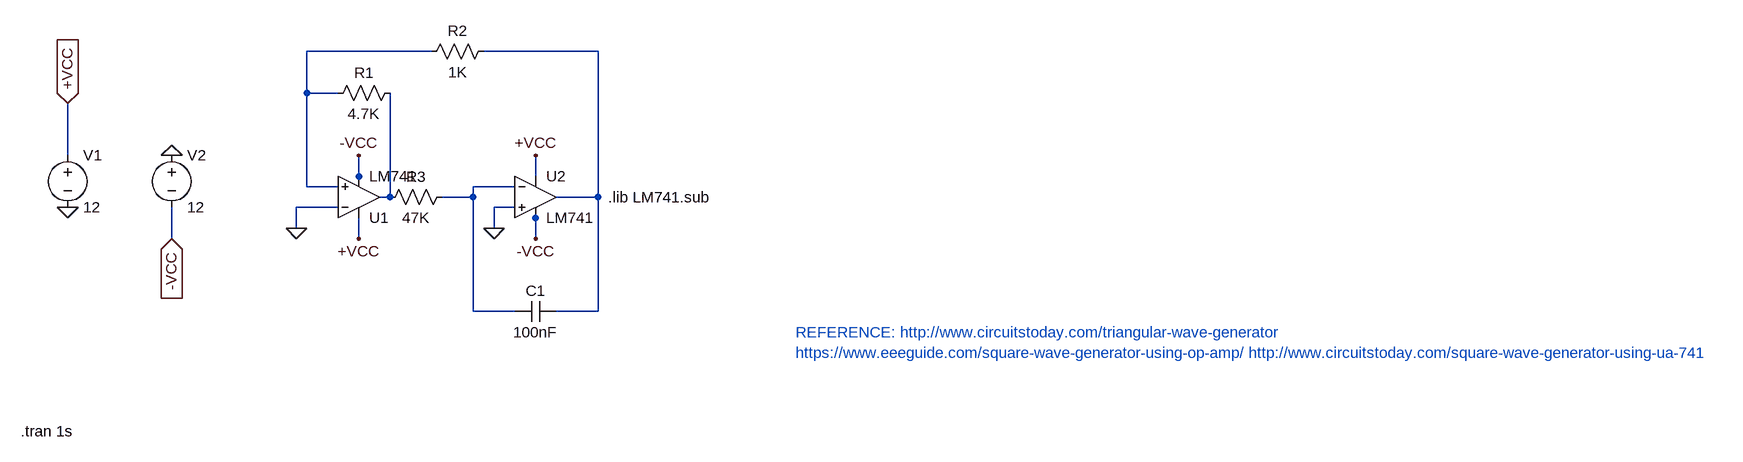
[diagram p0: schematic triangularwavegen.asc]
triangularwavegen.asc, the LTspice schematic file:
Version 4
SHEET 1 2448 680
WIRE 272 -112 80 -112
WIRE 528 -112 352 -112
WIRE 80 -48 80 -112
WIRE 128 -48 80 -48
WIRE -288 48 -288 -32
WIRE 160 80 160 48
WIRE 432 80 432 48
WIRE 80 96 80 -48
WIRE 128 96 80 96
WIRE 160 96 160 80
WIRE 400 96 336 96
WIRE 208 112 208 -48
WIRE 208 112 192 112
WIRE 336 112 336 96
WIRE 336 112 288 112
WIRE 528 112 528 -112
WIRE 528 112 464 112
WIRE 128 128 64 128
WIRE 400 128 368 128
WIRE 432 144 432 128
WIRE 64 160 64 128
WIRE 368 160 368 128
WIRE -128 176 -128 128
WIRE 160 176 160 144
WIRE 432 176 432 144
WIRE 336 288 336 112
WIRE 400 288 336 288
WIRE 528 288 528 112
WIRE 528 288 464 288
FLAG -288 128 0
FLAG -288 -32 +VCC
IOPIN -288 -32 In
FLAG -128 48 0
FLAG -128 176 -VCC
IOPIN -128 176 In
FLAG 160 48 -VCC
FLAG 432 48 +VCC
FLAG 160 176 +VCC
FLAG 432 176 -VCC
FLAG 64 160 0
FLAG 368 160 0
SYMBOL voltage -288 32 R0
WINDOW 123 0 0 Left 0
WINDOW 39 0 0 Left 0
SYMATTR InstName V1
SYMATTR Value 12
SYMBOL voltage -128 32 R0
WINDOW 123 0 0 Left 0
WINDOW 39 0 0 Left 0
SYMATTR InstName V2
SYMATTR Value 12
SYMBOL Opamps\\opamp2 160 176 M180
SYMATTR InstName U1
SYMATTR Value LM741
SYMBOL Opamps\\opamp2 432 48 R0
SYMATTR InstName U2
SYMATTR Value LM741
SYMBOL res 224 -64 R90
WINDOW 0 0 56 VBottom 2
WINDOW 3 32 56 VTop 2
SYMATTR InstName R1
SYMATTR Value 4.7K
SYMBOL res 368 -128 R90
WINDOW 0 0 56 VBottom 2
WINDOW 3 32 56 VTop 2
SYMATTR InstName R2
SYMATTR Value 1K
SYMBOL res 304 96 R90
WINDOW 0 0 56 VBottom 2
WINDOW 3 32 56 VTop 2
SYMATTR InstName R3
SYMATTR Value 47K
SYMBOL cap 464 272 R90
WINDOW 0 0 32 VBottom 2
WINDOW 3 32 32 VTop 2
SYMATTR InstName C1
SYMATTR Value 100nF
TEXT -360 472 Left 2 !.tran 1s
TEXT 832 320 Left 2 ;REFERENCE: http://www.circuitstoday.com/triangular-wave-generator\nhttps://www.eeeguide.com/square-wave-generator-using-op-amp/ http://www.circuitstoday.com/square-wave-generator-using-ua-741
TEXT 544 112 Left 2 !.lib LM741.sub

The netlist it stands for:
* triangularwavegen.asc
V1 +VCC 0 12
V2 0 -VCC 12
XU1 N001 0 +VCC -VCC N004 LM741  ; pins In+ In- V+ V- OUT
XU2 0 N003 +VCC -VCC N002 LM741  ; pins In+ In- V+ V- OUT
R1 N004 N001 4.7K
R2 N002 N001 1K
R3 N003 N004 47K
C1 N002 N003 100nF
.tran 1s
* REFERENCE: http://www.circuitstoday.com/triangular-wave-generator
* https://www.eeeguide.com/square-wave-generator-using-op-amp/ http://www.circuitstoday.com/square-wave-generator-using-ua-741
.lib LM741.sub
.backanno
.end